# EAGLE design CH554-dev-board (EAGLE 9.6.2)
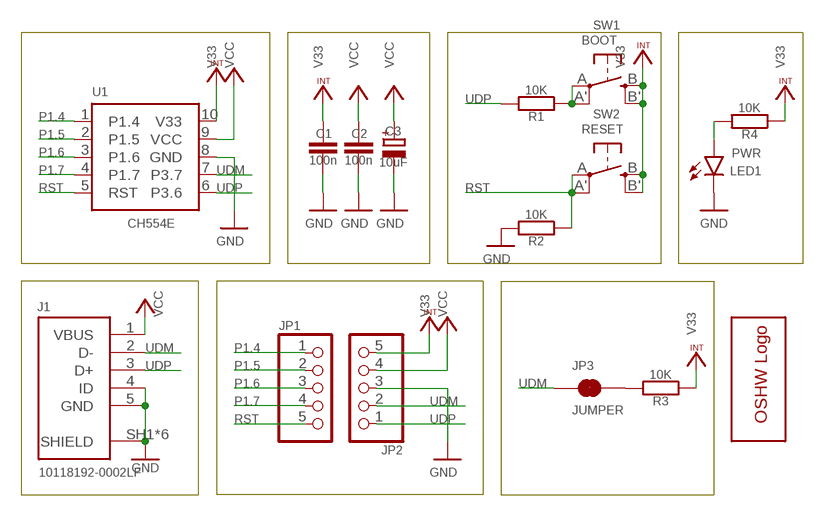
[diagram p0: schematic, sheet 1]

## Parts
C1  100n  C-EUC0603  [C0603]
C2  100n  C-EUC0603  [C0603]
C3  10uF  CPOL-EUA/3216-18R  [A/3216-18R]
GOLD_ORB_SM1  OSHWLOGOLOGO5MM  [OSHW_5MM]
J1  10118192-0002LF  [10118192-0002LF]
JP1  PINHD-1X5  [1X05]
JP2  PINHD-1X5  [1X05]
JP3  JUMPER  JUMPER-SMT_2_NC_TRACE_NO-SILK  [SMT-JUMPER_2_NC_TRACE_NO-SILK]
LED1  PWR  LEDCHIP-LED0603  [CHIP-LED0603]
R1  10K  R-EU_R0603  [R0603]
R2  10K  R-EU_R0603  [R0603]
R3  10K  R-EU_R0603  [R0603]
R4  10K  R-EU_R0603  [R0603]
SW1  BOOT  SPST_TACT-EVQQ2  [EVQ-Q2]
SW2  RESET  SPST_TACT-EVQQ2  [EVQ-Q2]
U1  CH554E  [MSOP10]

## Nets
GND: C1.2 C2.2 C3.- J1.4(ID) J1.5(GND) J1.SH1(SHIELD) J1.SH2(SHIELD) J1.SH3(SHIELD) J1.SH4(SHIELD) J1.SH5(SHIELD) J1.SH6(SHIELD) JP2.3 LED1.C R2.2 U1.8(GND)
N$1: R1.1 SW1.A'(P1) SW1.A(P)
N$2: LED1.A R4.2
N$3: JP3.2 R3.2
P1.4: JP1.1 U1.1(P1.4)
P1.5: JP1.2 U1.2(P1.5)
P1.6: JP1.3 U1.3(P1.6)
P1.7: JP1.4 U1.4(P1.7)
RST: JP1.5 R2.1 SW2.A'(P1) SW2.A(P) U1.5(RST)
UDM: J1.2(D-) JP2.2 JP3.1 U1.7(P3.7)
UDP: J1.3(D+) JP2.1 R1.2 U1.6(P3.6)
V33: C1.1 JP2.5 R3.1 R4.1 SW1.B'(S1) SW1.B(S) SW2.B'(S1) SW2.B(S) U1.10(V33)
VCC: C2.1 C3.+ J1.1(VBUS) JP2.4 U1.9(VCC)

## Library data of the parts
C1 C2 = rcl:C-EU: CAPACITOR, European symbol; JLCPCB: C14663; SPICEPREFIX: C
C3 = rcl:CPOL-EU: POLARIZED CAPACITOR, European symbol; JLCPCB: C7171; SPICEPREFIX: C
GOLD_ORB_SM1 = oshw:OSHWLOGO: The OSHW logo for PCB layout
J1 = USB connector:10118192-0002LF: CONN RCPT USB2.0 MICRO B SMD R/A Manufacturer's datasheet <https://www.amphenol-icc.com/media/wysiwyg/files/drawing/10118192.pdf>; CREATED_BY: PCBLayout.com; DIGIKEY_PARTNO: 609-5379-2-ND; JLCPCB: C2972784; MANUFACTURER: Amphenol ICC (FCI); MPN: 10118192-0002LF
JP1 JP2 = pinhead:PINHD-1X5: PIN HEADER
JP3 = SparkFun-Jumpers:JUMPER-SMT_2_NC_TRACE: Normally closed trace jumper This jumper has a trace between two pads so it's normally closed (NC). Use a razor knife to open the connection. For best results follow the IPC guidelines for cutting traces: Cutout at least 0.063 mm (0.005 in). Remove all loose material to clean up the cut area. Seal the cut with an approved epoxy. Reapply solder to reclose the connection.
LED1 = led:LED: LED OSRAM: - CHIPLED LG R971, LG N971, LY N971, LG Q971, LY Q971, LO R971, LY R971 LH N974, LH R974 LS Q976, LO Q976, LY Q976 LO Q996 - Hyper CHIPLED LW Q18S LB Q993, LB Q99A, LB R99A - SideLED LS A670, LO A670, LY A670, LG A670, LP A670 LB A673, LV A673, LT A673, LW A673 LH A674 LY A675 LS A676, LA A676, LO A676, LY A676, LW A676 LS A679, LY A679, LG A679 - Hyper Micro SIDELED® LS Y876, LA Y876, LO Y876, LY Y876 LT Y87S - SmartLED LW L88C, LW L88S LB L89C, LB L89S, LG L890 LS L89K, LO L89K, LY L89K LS L896, LA L896, LO L896, LY L896 - TOPLED LS T670, LO T670, LY T670, LG T670, LP T670 LSG T670, LSP T670, LSY T670, LOP T670, LYG T670 LG T671, LOG T671, LSG T671 LB T673, LV T673, LT T673, LW T673 LH T674 LS T676, LA T676, LO T676, LY T676, LB T676, LH T676, LSB T676, LW T676 LB T67C, LV T67C, LT T67C, LS T67K, LO T67K, LY T67K, LW E67C LS E67B, LA E67B, LO E67B, LY E67B, LB E67C, LV E67C, LT E67C LW T67C LS T679, LY T679, LG T679 LS T770, LO T770, LY T770, LG T770, LP T770 LB T773, LV T773, LT T773, LW T773 LH T774 LS E675, LA E675, LY E675, LS T675 LS T776, LA T776, LO T776, LY T776, LB T776 LHGB T686 LT T68C, LB T68C - Hyper Mini TOPLED® LB M676 - Mini TOPLED Santana® LG M470 LS M47K, LO M47K, LY M47K Source: http://www.osram.convergy.de LUXEON: - LUMILED® LXK2-PW12-R00, LXK2-PW12-S00, LXK2-PW14-U00, LXK2-PW14-V00 LXK2-PM12-R00, LXK2-PM12-S00, LXK2-PM14-U00 LXK2-PE12-Q00, LXK2-PE12-R00, LXK2-PE12-S00, LXK2-PE14-T00, LXK2-PE14-U00 LXK2-PB12-K00, LXK2-PB12-L00, LXK2-PB12-M00, LXK2-PB14-N00, LXK2-PB14-P00, LXK2-PB14-Q00 LXK2-PR12-L00, LXK2-PR12-M00, LXK2-PR14-Q00, LXK2-PR14-R00 LXK2-PD12-Q00, LXK2-PD12-R00, LXK2-PD12-S00 LXK2-PH12-R00, LXK2-PH12-S00 LXK2-PL12-P00, LXK2-PL12-Q00, LXK2-PL12-R00 Source: www.luxeon.com KINGBRIGHT: KA-3528ASYC Source: www.kingbright.com; JLCPCB: C72043
R1-R4 = rcl:R-EU_: RESISTOR, European symbol; JLCPCB: C25804; SPICEPREFIX: R
SW1 SW2 = adafruit:SPST_TACT: SMT 6mm switch, EVQQ2 series http://www.ladyada.net/library/eagle; JLCPCB: C221880
U1 = CH554E:CH554E

## Board
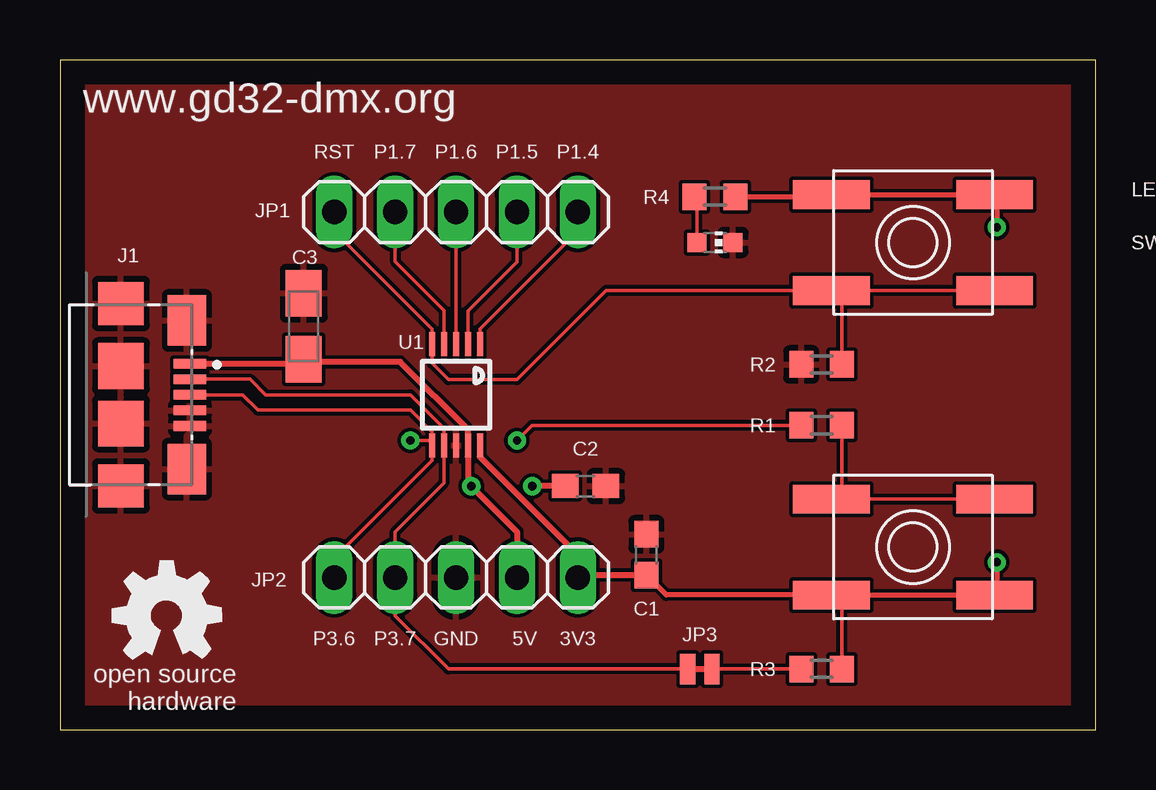
[diagram p1: board, top side]
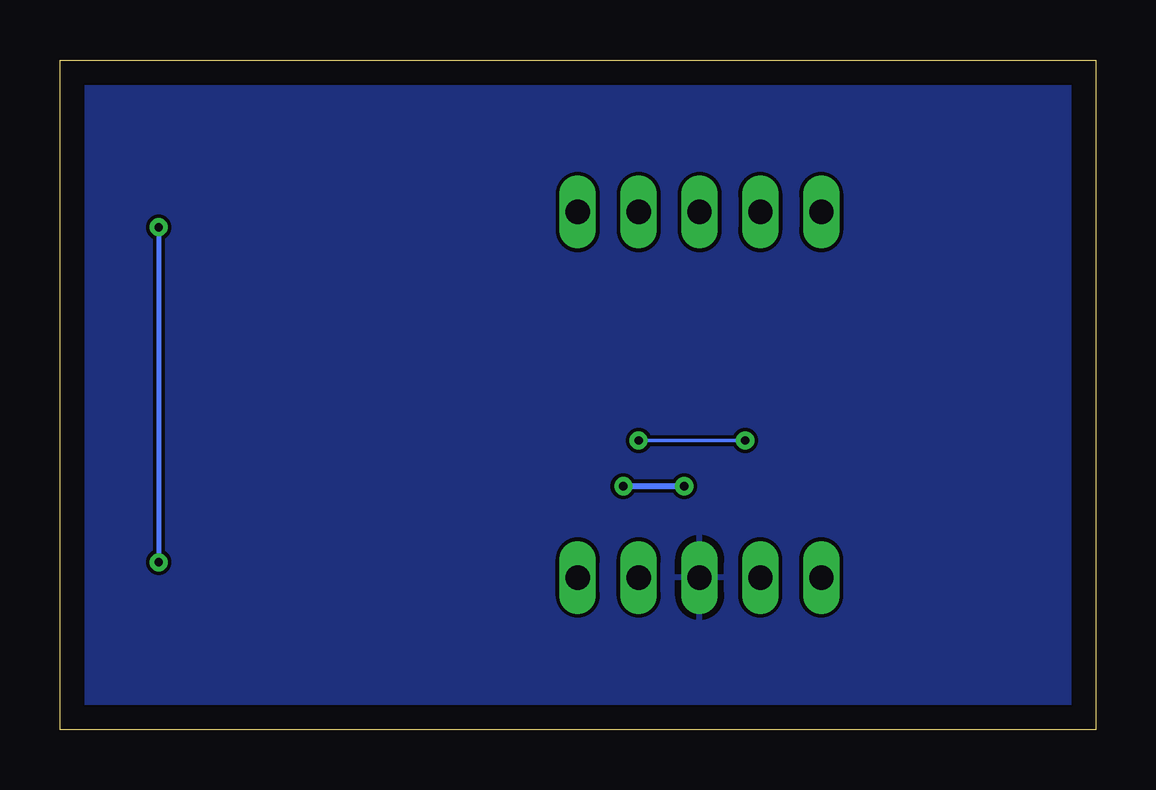
[diagram p2: board, bottom side, seen from below]

Size 43.17 x 27.93 mm. Coordinates in mm from the lower left corner, seen from the top.
Outline: 0,0 43.17,0 43.17,27.93 0,27.93 0,0
Copper layers (1*16): Top 0.035mm / dielectric 1.5mm / Bottom 0.035mm
Design rules "default": minimum track width 6mil, minimum drill 0.35mm, track to track 6mil, track to pad 6mil, pad to pad 6mil, via to via 6mil, smd to smd 6mil, copper to edge 40mil, drill to drill 6mil, minimum pad ring 10mil, minimum via ring 8mil, stop-mask expansion 4mil, vias tented up to drill 0mil, thermal gap 10mil

### Footprints (pad centres in the part's own frame; a part is rotated, then mirrored left to right if it is on the bottom)
C0603 = smd 1.1 x 1: 1 -0.85,0; 2 0.85,0
A/3216-18R = smd 1.95 x 1.5: + 1.375,0; - -1.375,0
10118192-0002LF = smd 0.4 x 1.35: 1 -1.3,2.875; 2 -0.65,2.875; 3 0,2.875; 4 0.65,2.875; 5 1.3,2.875 | smd 2.1 x 1.6: SH1 -3.1,2.75; SH2 3.1,2.75 | smd 1.8 x 1.9: SH3 -3.8,0; SH4 3.8,0 | smd 1.9 x 1.9: SH5 -1.2,0; SH6 1.2,0
1X05 = drill 1.016 long: 1 -5.08,0; 2 -2.54,0; 3 0,0; 4 2.54,0; 5 5.08,0
SMT-JUMPER_2_NC_TRACE_NO-SILK = smd 0.635 x 1.27: 1 -0.508,0; 2 0.508,0
CHIP-LED0603 = smd 0.8 x 0.8: A 0,-0.75; C 0,0.75
R0603 = smd 1 x 1.1: 1 -0.85,0; 2 0.85,0
EVQ-Q2 = smd 3.2 x 1.2: A -3.4,-2; A' 3.4,-2; B -3.4,2; B' 3.4,2
MSOP10 = smd 0.25 x 1: 1 -1,-2.113; 2 -0.5,-2.113; 3 0,-2.113; 4 0.5,-2.113; 5 1,-2.113; 6 1,2.113; 7 0.5,2.113; 8 0,2.113; 9 -0.5,2.113; 10 -1,2.113

### Placement (x,y rotation side)
C1  24.45,7.3 90 top
C2  21.91,10.16 0 top
C3  10.16,16.83 270 top
GOLD_ORB_SM1  4.45,4.76 0 top
J1  2.54,13.97 270 top
JP1  16.51,21.59 180 top
JP2  16.51,6.35 0 top
JP3  26.67,2.54 0 top
LED1  27.3,20.32 270 top
R1  31.75,12.7 180 top
R2  31.75,15.24 180 top
R3  31.75,2.54 180 top
R4  27.3,22.23 180 top
SW1  35.56,7.62 180 top
SW2  35.56,20.32 0 top
U1  16.51,13.97 180 top

### Tracks (layer width: path | path; a pad name or v marks a point on that pad's centre or on a via)
GND
  pour Top: 0,0 43.18,0 43.18,27.94 0,27.94
  pour Bottom: 0,0 43.18,0 43.18,27.94 0,27.94
N$1
  Top 0.152: SW1.A SW1.A' 32.6,10.06 R1.1
N$2
  Top 0.152: LED1.A 26.55,22.12 R4.2
N$3
  Top 0.152: JP3.2 R3.2
P1.4
  Top 0.152: U1.1 17.51,16.72 21.59,20.8 JP1.1
P1.5
  Top 0.152: JP1.2 19.05,19.5 17.01,17.46 U1.2
P1.6
  Top 0.152: U1.3 JP1.3
P1.7
  Top 0.152: U1.4 16.01,17.48 13.97,19.52 JP1.4
RST
  Top 0.152: SW2.A' 32.38,18.32 | 32.38,18.32 SW2.A 22.77,18.32 19.05,14.61 16.19,14.61 15.51,15.29 U1.5 15.51,16.72 11.43,20.8 JP1.5 | R2.1 32.6,18.11 32.38,18.32
UDM
  Top 0.152: J1.2 7.92,14.62 8.57,13.97 14.61,13.97 16.01,12.56 U1.7 16.01,10.29 13.97,8.26 JP2.2 13.97,4.76 16.19,2.54 JP3.1
UDP  (via drill 0.35)
  Top 0.152: J1.3 7.62,13.97 8.26,13.34 14.61,13.34 15.51,12.43 U1.6 | U1.6 15.51,11.22 11.43,7.14 JP2.1 | U1.6 15.51,12.06 v14.61,12.06 | R1.2 19.68,12.7 v19.05,12.06
  Bottom 0.152: v19.05,12.06 v14.61,12.06
V33  (via drill 0.35)
  Top 0.152: SW2.B 32.7,22.32 32.61,22.23 | SW1.B' 32.7,5.62 32.6,5.52 R3.1 | SW1.B 38.73,5.62 39.05,5.94 | SW2.B' 39.05,22.23
  Top 0.203: 32.7,5.62 38.73,5.62 | R4.1 32.61,22.23 | SW1.B' 25.28,5.62 C1.1 | v39.05,6.99 39.05,5.94 | 39.05,22.23 v39.05,20.95 | SW2.B SW2.B'
  Top 0.254: U1.10 17.51,11.38 21.59,7.3 JP2.5 21.69,6.45 C1.1
  Bottom 0.203: v39.05,20.95 v39.05,6.99
VCC  (via drill 0.35)
  Top 0.152: 10.05,15.35 C3.+
  Top 0.254: JP2.4 19.05,8.26 v17.14,10.16 17.01,10.29 U1.9 17.01,12.52 14.18,15.35 10.05,15.35 9.98,15.27 J1.1 | C2.1 v19.68,10.16
  Bottom 0.254: v19.68,10.16 v17.14,10.16

### Text on the board
tNames: www.gd32-dmx.org | RST | P1.7 | P1.6 | P1.5 | P1.4 | P3.6 | P3.7 | GND | 5V | 3V3